# EasyEDA Pro project ProPrj_Devboard_V2_2025-07-15.epro, schematic Schematic1, sheets 1 to 3 of 7

## Sheets
1 P1: Board Name: Board1; Create Date: 2025-05-25; Page Name: P1; Project Name: Devboard_V2; Schematic Name: Schematic1; Update Date: 2025-07-09; Company: EasyEDA.com; Page Size: A4; Version: V1.0
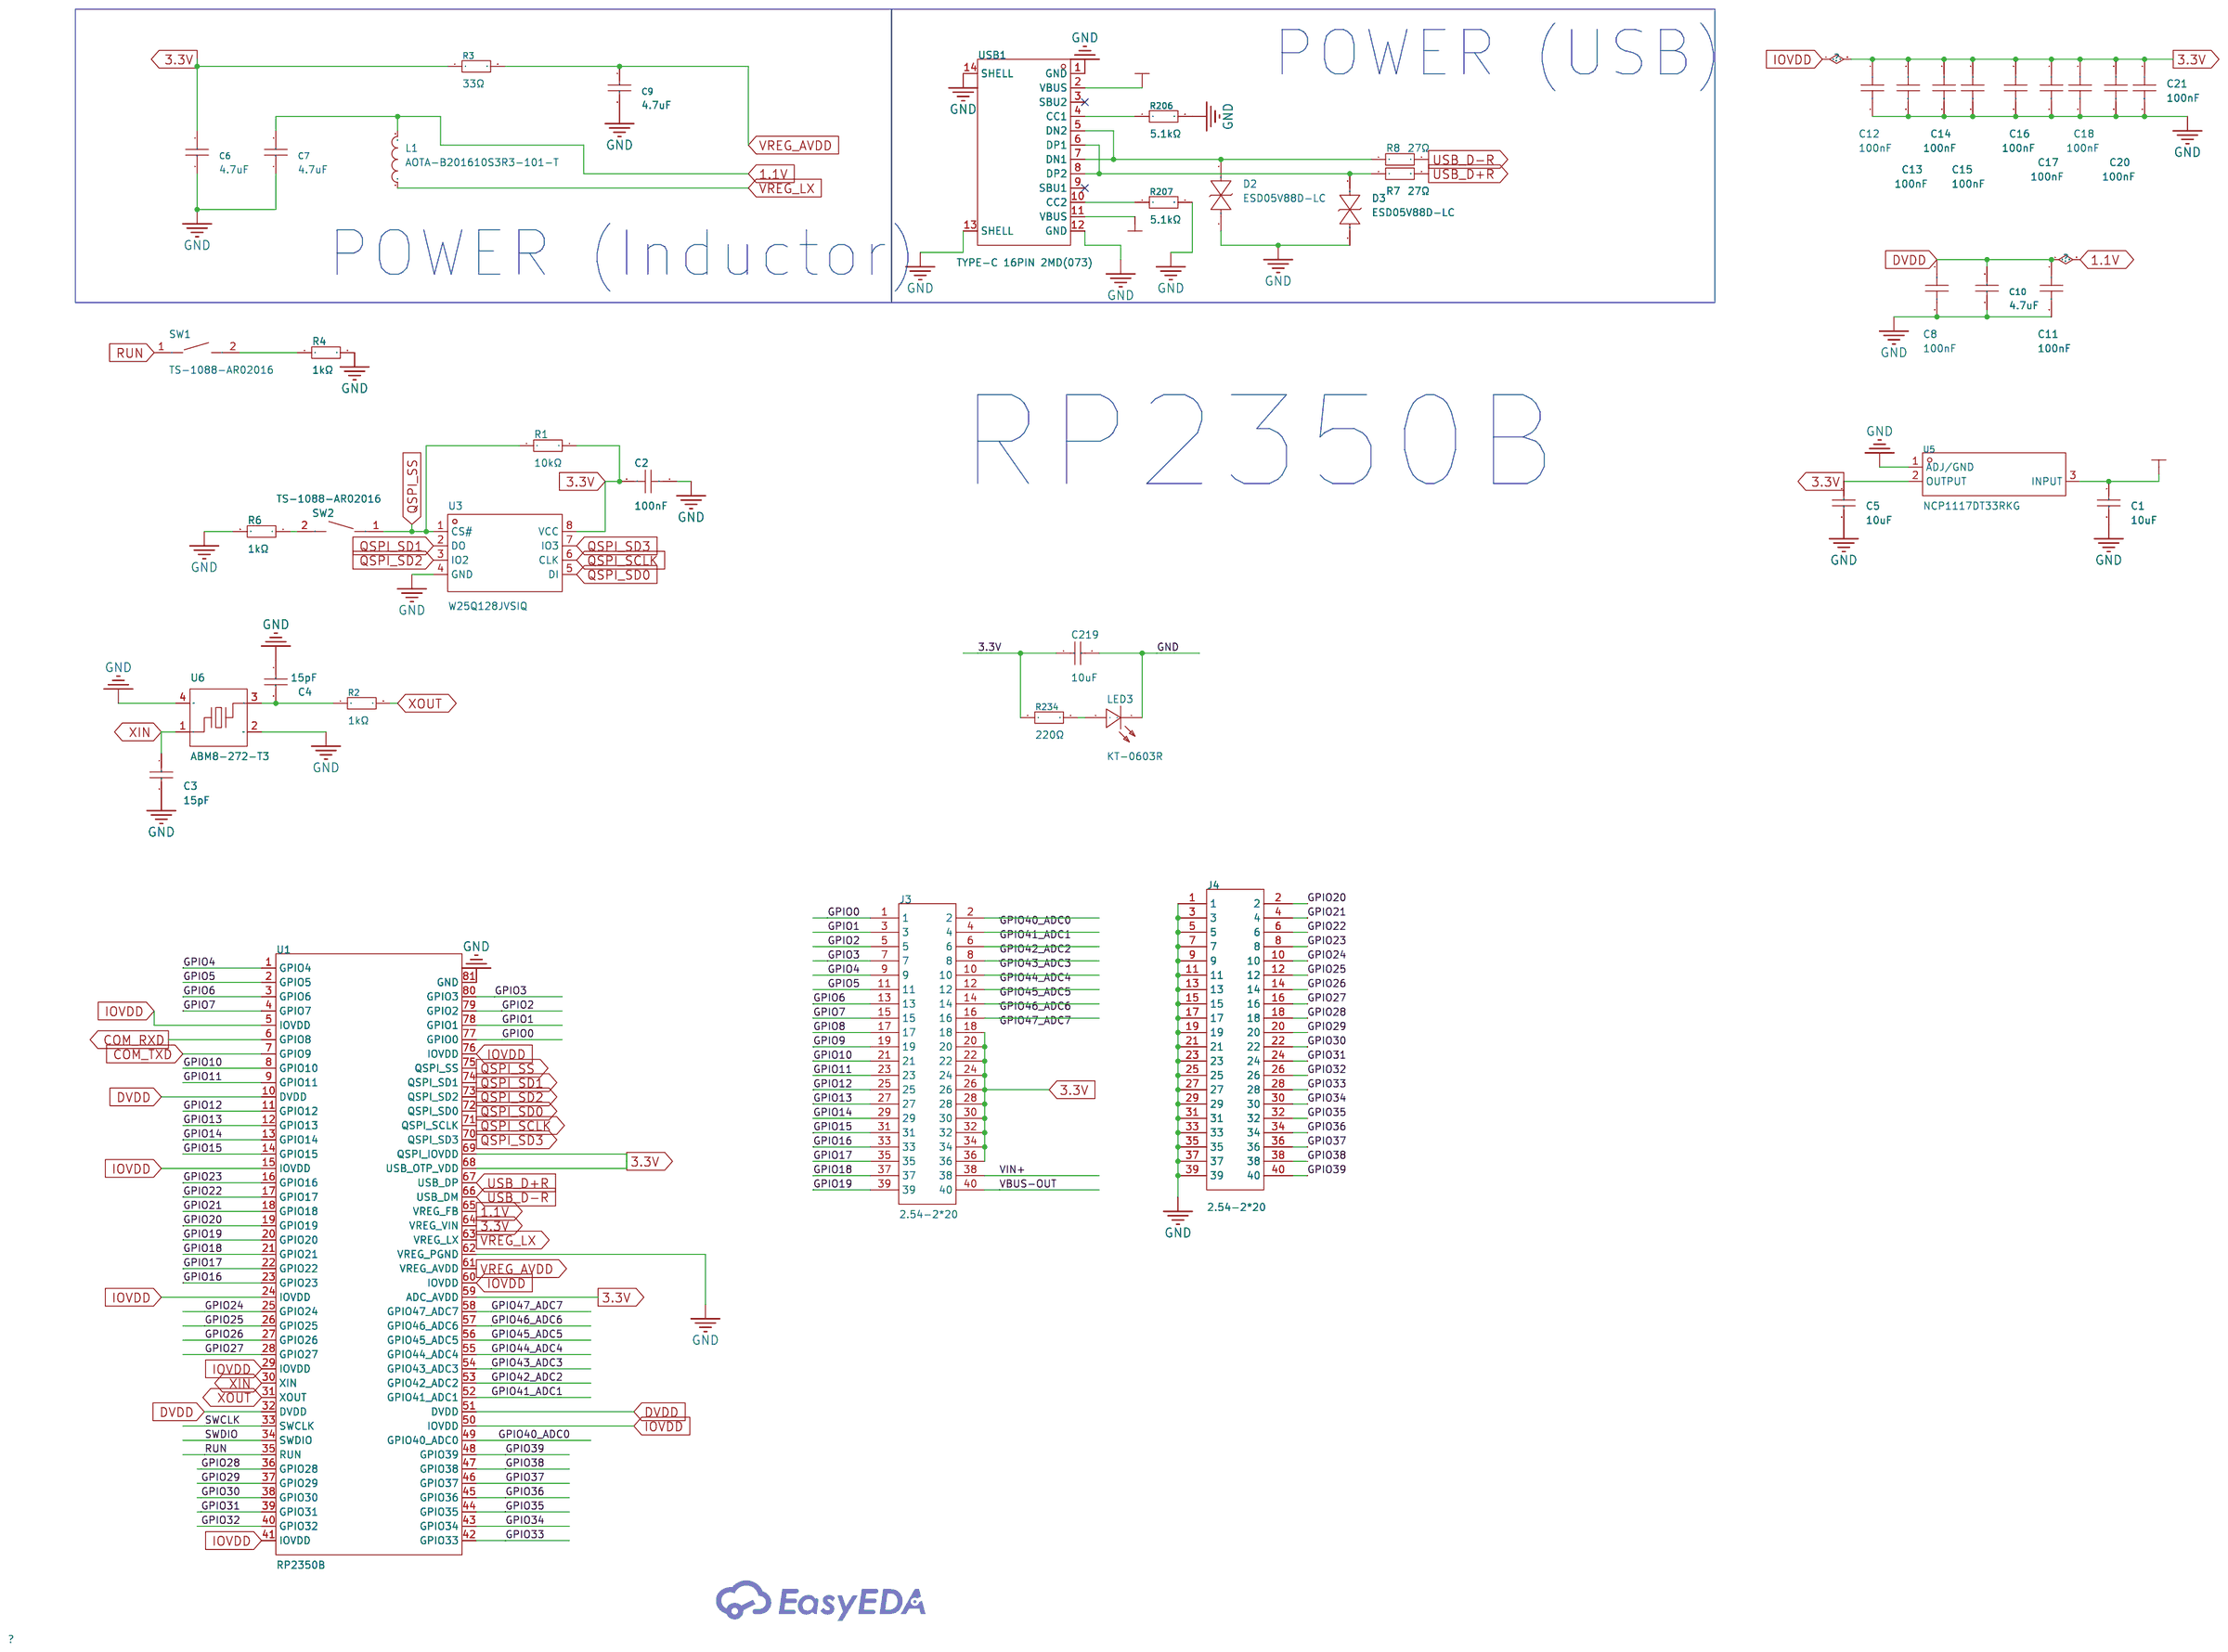
[diagram p0: P1]
2 P2: Create Date: 2025-05-26; Page Name: P2
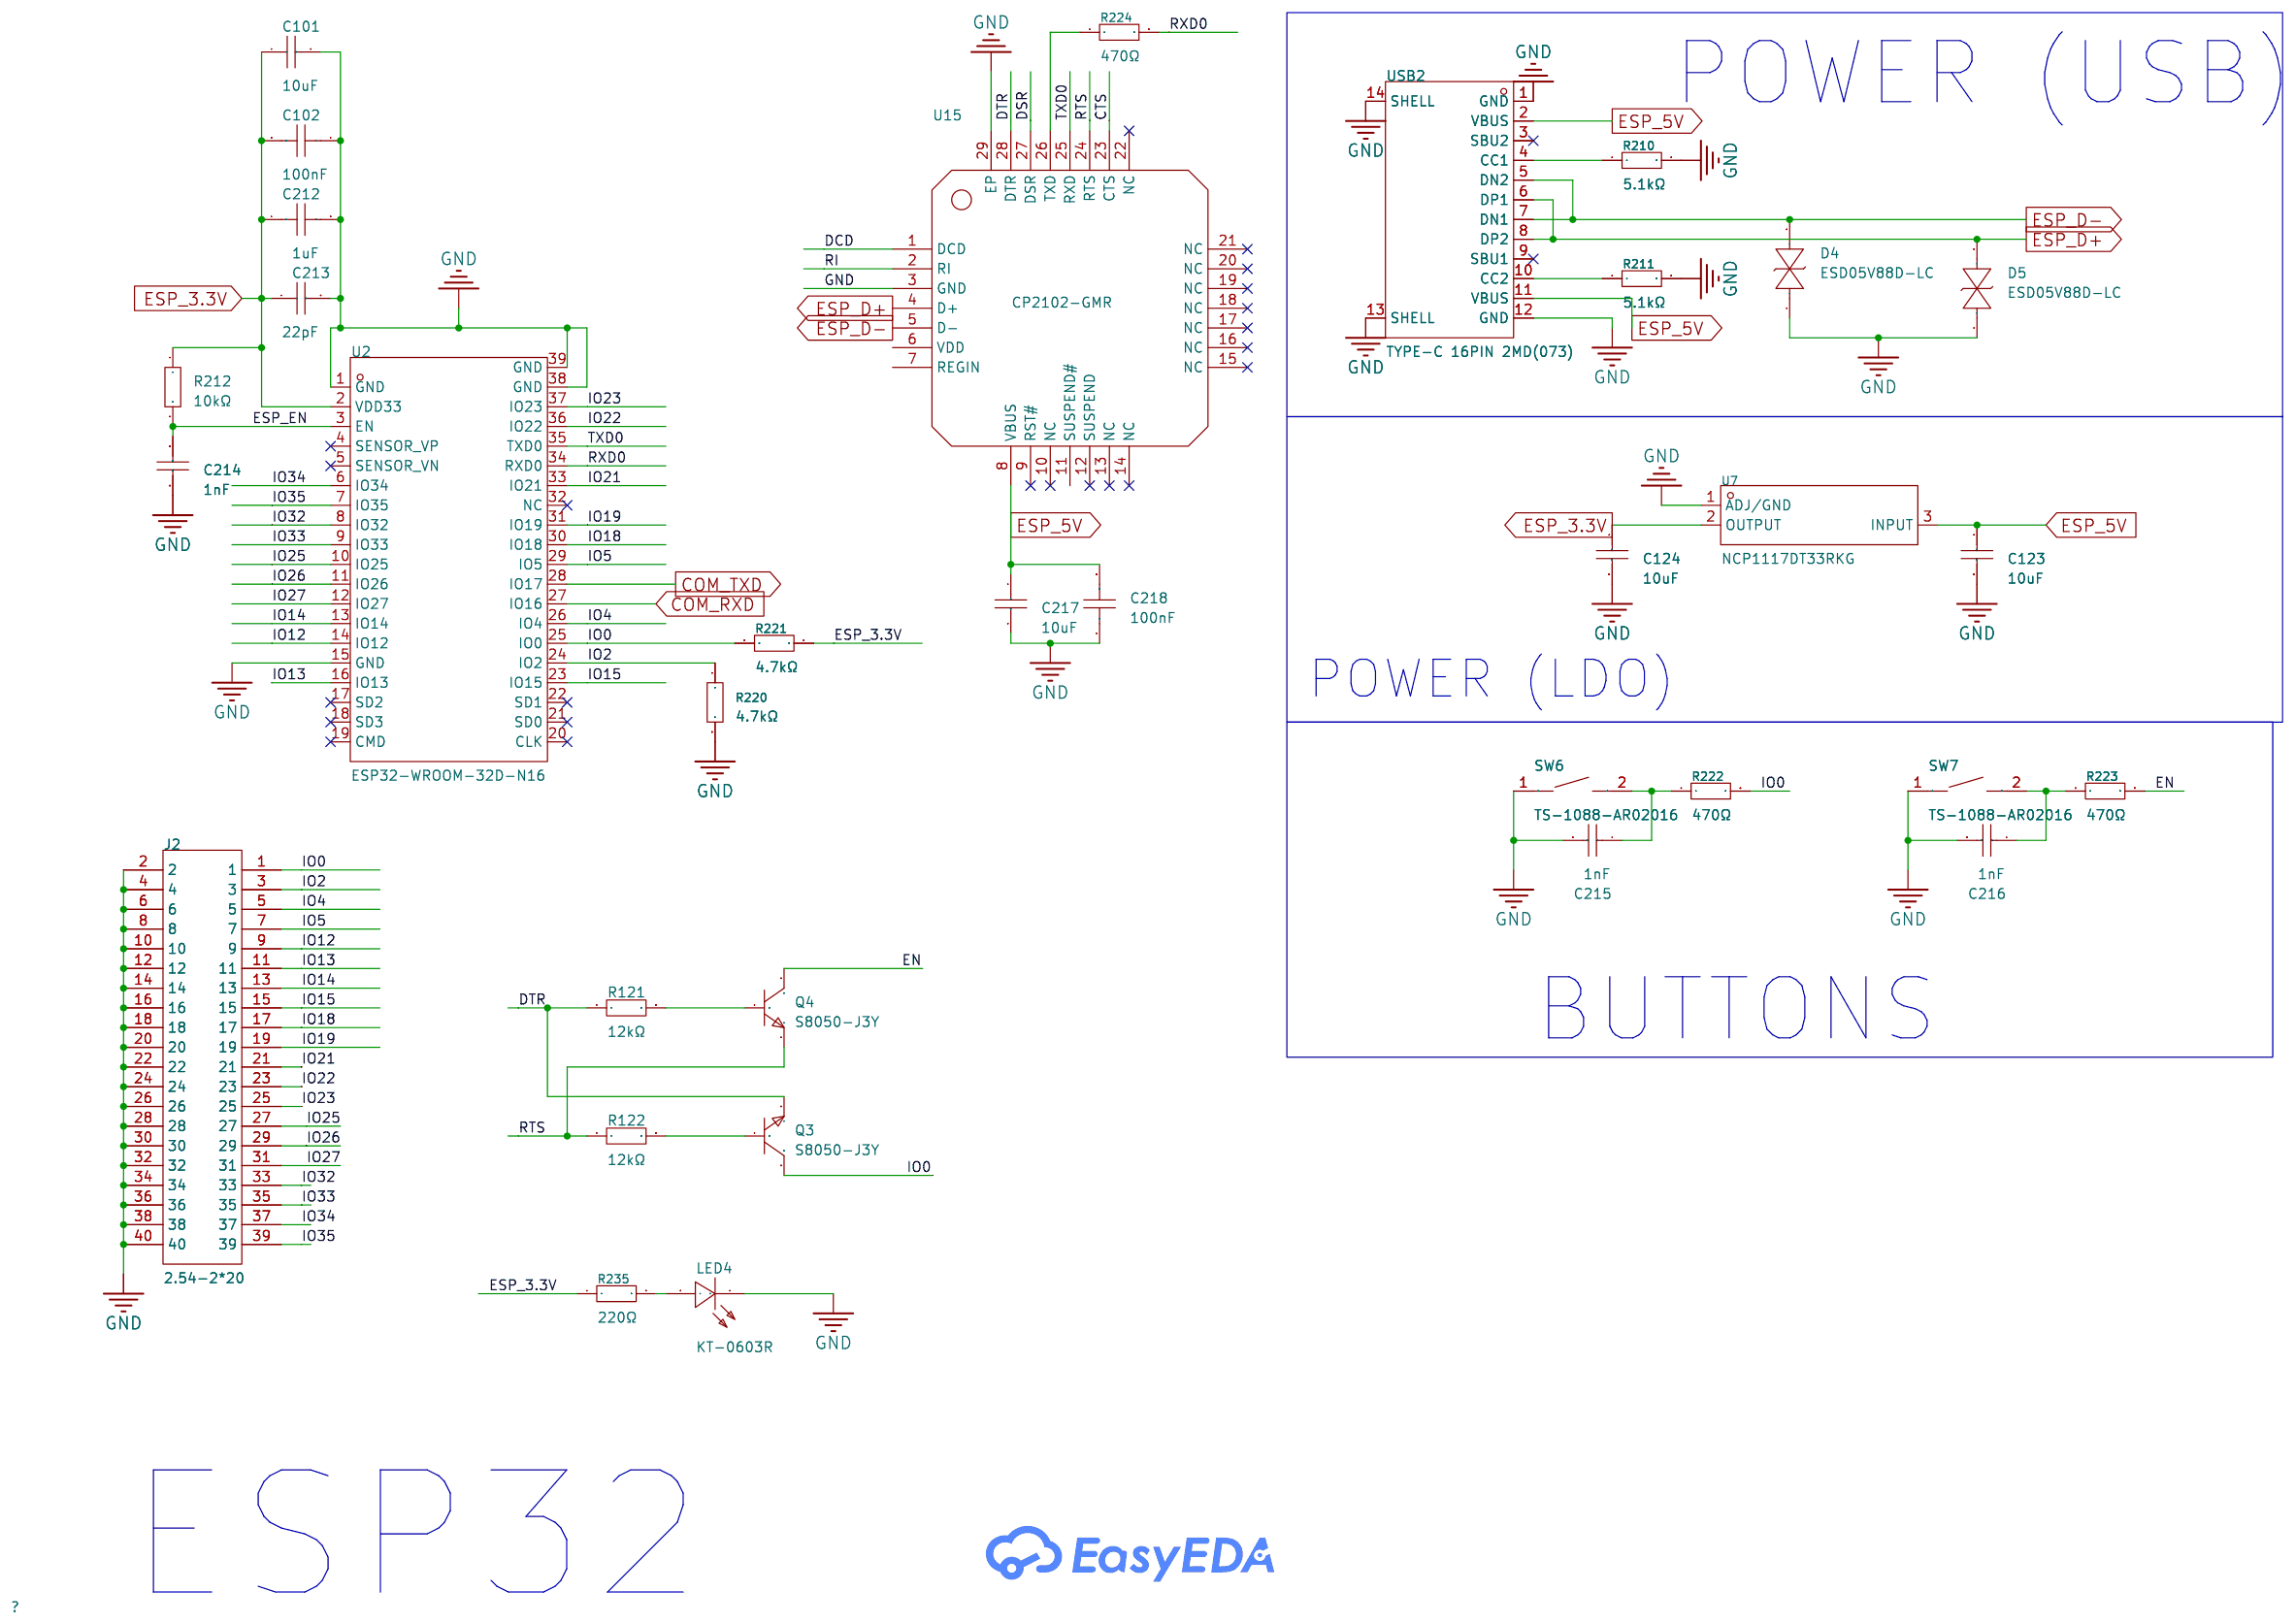
[diagram p1: P2]
3 P3: Create Date: 2025-06-10; Page Name: P3; Update Date: 2025-07-14
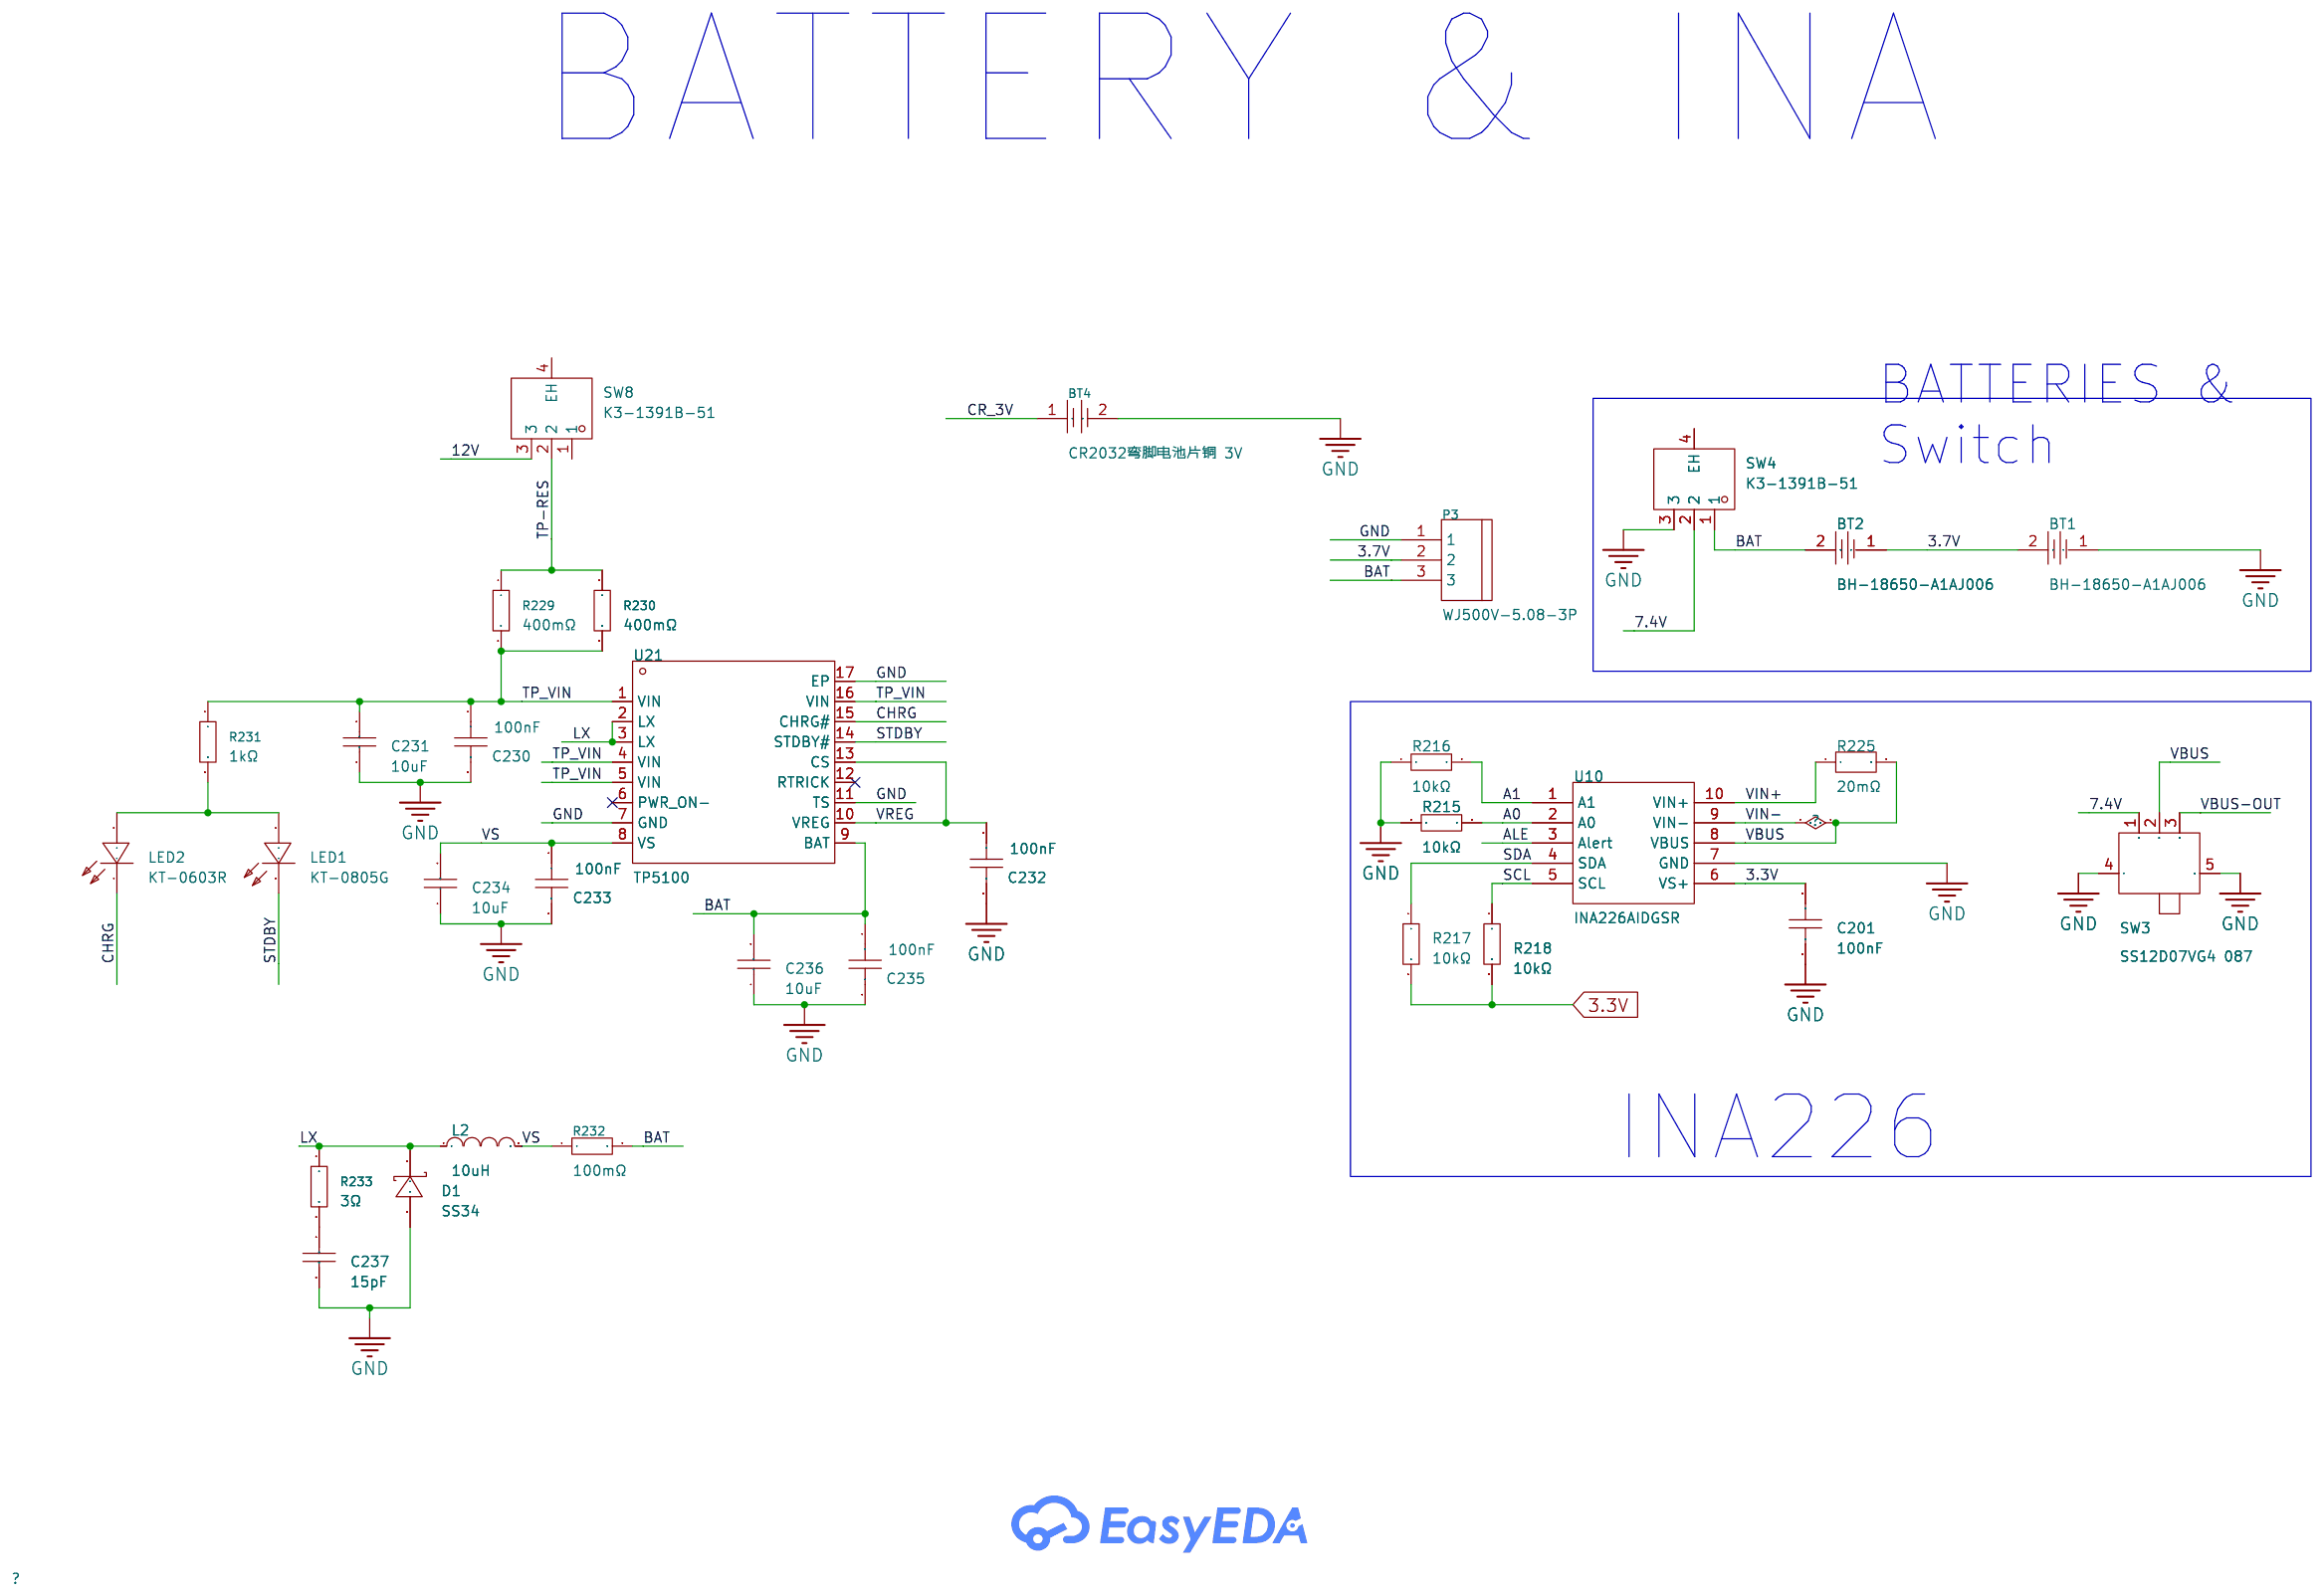
[diagram p2: P3]

## Parts
sheet P1
C1  10uF  [C0402]
C2  100nF  [C0402]
C3  15pF  [C0402]
C4  15pF  [C0402]
C5  10uF  [C0402]
C6  4.7uF  [C0402]
C7  4.7uF  [C0402]
C8  100nF  [C0402]
C9  4.7uF  [C0402]
C10  4.7uF  [C0402]
C11  100nF  [C0402]
C12  100nF  [C0402]
C13  100nF  [C0402]
C14  100nF  [C0402]
C15  100nF  [C0402]
C16  100nF  [C0402]
C17  100nF  [C0402]
C18  100nF  [C0402]
C20  100nF  [C0402]
C21  100nF  [C0402]
C219  10uF  [C0402]
D2  ESD05V88D-LC  [DFN1006-2L-BI]
D3  ESD05V88D-LC  [DFN1006-2L-BI]
J3  2.54-2*20  [HDR-TH_40P-P2.54-V-F-R2-C20-S2.54]
J4  2.54-2*20  [HDR-TH_40P-P2.54-V-F-R2-C20-S2.54]
L1  AOTA-B201610S3R3-101-T  [IND-SMD_L2.0-W1.6_AOTA-B201610S3R3-101-T]
LED3  KT-0603R  [LED0603-RD]
R1  10kΩ  [R0402]
R2  1kΩ  [R0402]
R3  33Ω  [R0402]
R4  1kΩ  [R0402]
R6  1kΩ  [R0402]
R7  27Ω  [R0402]
R8  27Ω  [R0402]
R206  5.1kΩ  [R0402]
R207  5.1kΩ  [R0402]
R234  220Ω  [R0603]
SW1  TS-1088-AR02016  [SW-SMD_L3.9-W3.0-P4.45]
SW2  TS-1088-AR02016  [SW-SMD_L3.9-W3.0-P4.45]
U1  RP2350B  [QFN-80_L10.0-W10.0-P0.40-TL-EP3.4]
U3  W25Q128JVSIQ  [SOIC-8_L5.3-W5.3-P1.27-LS8.0-BL]
U5  NCP1117DT33RKG  [TO-252-2_L6.6-W6.1-P4.57-LS9.9-TL-CW]
U6  ABM8-272-T3  [CRYSTAL-SMD_4P-L3.2-W2.5-BL]
USB1  TYPE-C 16PIN 2MD(073)  [USB-C-SMD_TYPE-C-6PIN-2MD-073]
sheet P2
C101  10uF  [C0402]
C102  100nF  [C0402]
C123  10uF  [C0402]
C124  10uF  [C0402]
C212  1uF  [C0402]
C213  22pF  [C0402]
C214  1nF  [C0402]
C215  1nF  [C0402]
C216  1nF  [C0402]
C217  10uF  [C0402]
C218  100nF  [C0402]
D4  ESD05V88D-LC  [DFN1006-2L-BI]
D5  ESD05V88D-LC  [DFN1006-2L-BI]
J2  2.54-2*20  [HDR-TH_40P-P2.54-V-F-R2-C20-S2.54]
LED4  KT-0603R  [LED0603-RD]
Q3  S8050-J3Y  [SOT-23-3_L3.0-W1.7-P0.95-LS2.9-BR]
Q4  S8050-J3Y  [SOT-23-3_L3.0-W1.7-P0.95-LS2.9-BR]
R121  12kΩ  [R0402]
R122  12kΩ  [R0402]
R210  5.1kΩ  [R0402]
R211  5.1kΩ  [R0402]
R212  10kΩ  [R0402]
R220  4.7kΩ  [R0402]
R221  4.7kΩ  [R0402]
R222  470Ω  [R0402]
R223  470Ω  [R0402]
R224  470Ω  [R0402]
R235  220Ω  [R0603]
SW6  TS-1088-AR02016  [SW-SMD_L3.9-W3.0-P4.45]
SW7  TS-1088-AR02016  [SW-SMD_L3.9-W3.0-P4.45]
U2  ESP32-WROOM-32D-N16  [WIFIM-SMD_39P-L25.5-W18.0-P1.27-BL]
U7  NCP1117DT33RKG  [TO-252-2_L6.6-W6.1-P4.57-LS9.9-TL-CW]
U15  CP2102-GMR  [WQFN-28_L5.0-W5.0-P0.50-BL-EP3.2]
USB2  TYPE-C 16PIN 2MD(073)  [USB-C-SMD_TYPE-C-6PIN-2MD-073]
sheet P3
BT1  BH-18650-A1AJ006  [BAT-TH_BH-18650-A1AJ006]
BT2  BH-18650-A1AJ006  [BAT-TH_BH-18650-A1AJ006]
BT4  CR2032弯脚电池片铜 3V  [BAT-SMD_CR2032-3V]
C201  100nF  [C0402]
C230  100nF  [C0402]
C231  10uF  [C0603]
C232  100nF  [C0402]
C233  100nF  [C0402]
C234  10uF  [C0603]
C235  100nF  [C0402]
C236  10uF  [C0603]
C237  15pF  [C0402]
D1  SS34  [SMA_L4.3-W2.6-LS5.2-RD]
L2  10uH  [IND-SMD_L5.4-W5.2_FXL0530]
LED1  KT-0805G  [LED0805-R-RD]
LED2  KT-0603R  [LED0603-RD]
P3  WJ500V-5.08-3P  [CONN-TH_3P-P5.00_WJ500V-5.08-3P]
R215  10kΩ  [R0402]
R216  10kΩ  [R0402]
R217  10kΩ  [R0402]
R218  10kΩ  [R0402]
R225  20mΩ  [RES-SMD_L6.4-W3.2-R2512]
R229  400mΩ  [R1206]
R230  400mΩ  [R1206]
R231  1kΩ  [R0402]
R232  100mΩ  [R1206]
R233  3Ω  [R0402]
SW3  SS12D07VG4 087  [SW-TH_SS12D07VG4]
SW4  K3-1391B-51  [SW-TH_K3-1391B-51]
SW8  K3-1391B-51  [SW-TH_K3-1391B-51]
U10  INA226AIDGSR  [MSOP-10_L3.0-W3.0-P0.50-LS5.0-BL]
U21  TP5100  [TQFN-16_L4.0-W4.0-P0.65-BL-EP]

## Library data of the parts
C1 C5 C101 C123 C124 C217 C219 = CL05A106MQ5NUNC: Capacitance: Tolerance:±20% Tolerance:±20% Voltage Rated: Temperature Coefficient:; LCSC Part Name: 10uF ±20% 6.3V; Supplier Part: C15525; Manufacturer: SAMSUNG(三星); Supplier Footprint: 0402; JLCPCB Part Class: Basic Part; Datasheet: https://atta.szlcsc.com/upload/public/pdf/source/20220823/2B02EE04F8F211D38A52DCB16EB6BEBA.pdf; Supplier: LCSC; Tolerance: ±20%
C2 C8 C11-C18 C20 C21 C102 C201 C218 C230 C232 C233 C235 = CL05B104KO5NNNC: Capacitance: Tolerance:±10% Tolerance:±10% Voltage Rated: Temperature Coefficient:; LCSC Part Name: 100nF ±10% 16V; Supplier Part: C1525; Manufacturer: SAMSUNG(三星); Supplier Footprint: 0402; JLCPCB Part Class: Basic Part; Datasheet: https://atta.szlcsc.com/upload/public/pdf/source/20160218/1457707763339.pdf; Supplier: LCSC; Tolerance: ±10%
C3 C4 C237 = 0402CG150J500NT: Capacitance: Tolerance:±5% Tolerance:±5% Voltage Rated: Temperature Coefficient:; LCSC Part Name: 15pF ±5% 50V; Supplier Part: C1548; Manufacturer: FH(风华); Supplier Footprint: 0402; JLCPCB Part Class: Basic Part; Datasheet: https://atta.szlcsc.com/upload/public/pdf/source/20200305/C486355_26A10D38EF8C2A5C37091D0039909270.pdf; Supplier: LCSC; Tolerance: ±5%
C6 C7 C9 C10 = CL05A475MP5NRNC: Capacitance: Tolerance:±20% Tolerance:±20% Voltage Rated: Temperature Coefficient:; LCSC Part Name: 4.7uF ±20% 10V; Supplier Part: C23733; Manufacturer: SAMSUNG(三星); Supplier Footprint: 0402; JLCPCB Part Class: Basic Part; Datasheet: https://atta.szlcsc.com/upload/public/pdf/source/20160218/1457707763339.pdf; Supplier: LCSC; Tolerance: ±20%
D2-D5 = ESD05V88D-LC_C5139330: Supplier Part: C5139330; Manufacturer: Leiditech(雷卯电子); Supplier Footprint: DFN1006; JLCPCB Part Class: Extended Part; Datasheet: https://atta.szlcsc.com/upload/public/pdf/source/20220816/2C4BB2D73BD9CA5940291356D3492357.pdf; Supplier: LCSC
J2-J4 = 2.54-2*20: Holes Structure:2x20P Pitch:2.54mm Row Spacing:2.54mm Circular Hole / Square Hole:Square Holes Mounting Type:Straight Number of Rows:双排 Number of Holes:40P Current Rating (Max):2.5A Voltage Rating (Max):- Holes Direction:Top Insulation Height:8.5mm Operat; LCSC Part Name: 间距:2.54mm 2x20P 直插; Supplier Part: C2977589; Manufacturer: ZHOURI(洲日); Supplier Footprint: 插件,P=2.54mm; JLCPCB Part Class: Extended Part; Datasheet: https://atta.szlcsc.com/upload/public/pdf/source/20220328/834E302BE3C038BBC5C70F5E02589B1E.pdf; Supplier: LCSC; Holes Structure: 2x20P; Pitch: 2.54mm; Row Spacing: 2.54mm; Circular Hole / Square Hole: Square Holes; Mounting Type: Straight; Number of Rows: 双排; Number of Holes: 40P; Current Rating (Max): 2.5A; Holes Direction: Top; Insulation Height: 8.5mm; Operating Temperature Range: -40℃~+105℃
L1 = AOTA-B201610S3R3-101-T: Supplier Part: C42411119; Manufacturer: ABRACON; Supplier Footprint: 0806; JLCPCB Part Class: Extended Part; Datasheet: https://atta.szlcsc.com/upload/public/pdf/source/20241210/8ED7235334351200B2CE75E3CBC0DAAD.pdf; Supplier: LCSC
LED2-LED4 = KT-0603R: Emitted Color:Red Power Dissipation:- Forward Current:- Dominant Wavelength:- Dominant Wavelength:- Peak Wavelength:- Diode Configuration:- Lens Color:- Color Temperature:- Color Temperature:- Viewing Angle:- Mounting Sytle:- Operating Temperature:-40℃~+8; LCSC Part Name: 0603 红灯 高亮; Supplier Part: C2286; Manufacturer: KENTO; Supplier Footprint: 0603; JLCPCB Part Class: Basic Part; Datasheet: https://atta.szlcsc.com/upload/public/pdf/source/20160616/1466072038404.pdf; Supplier: LCSC; Emitted Color: Red; Operating Temperature: -40℃~+85℃
R1 R212 R215-R218 = 0402WGF1002TCE: Type:Thick Film Resistors Resistance:10kΩ Tolerance:±1% Tolerance:±1% Power(Watts): Overload Voltage (Max): Temperature Coefficient:±100ppm/℃ Temperature Coefficient:±100ppm/℃ Operating Temperature Range:-55℃~+155℃ Operating Temperature Range:-55℃~+155℃; LCSC Part Name: 10kΩ ±1% 62.5mW 厚膜电阻; Supplier Part: C25744; Manufacturer: UNI-ROYAL(厚声); Supplier Footprint: 0402; JLCPCB Part Class: Basic Part; Datasheet: https://atta.szlcsc.com/upload/public/pdf/source/20200306/C422600_1E6D84923E4A46A82E41ADD87F860B5C.pdf; Supplier: LCSC; Type: Thick Film Resistors; Tolerance: ±1%; Temperature Coefficient: ±100ppm/℃; Operating Temperature Range: -55℃~+155℃
R2 R4 R6 R231 = 0402WGF1001TCE: Type:Thick Film Resistors Resistance:1kΩ Tolerance:±1% Tolerance:±1% Power(Watts): Overload Voltage (Max): Temperature Coefficient:±100ppm/℃ Temperature Coefficient:±100ppm/℃ Operating Temperature Range:-55℃~+155℃ Operating Temperature Range:-55℃~+155℃; LCSC Part Name: 1kΩ ±1% 62.5mW 厚膜电阻; Supplier Part: C11702; Manufacturer: UNI-ROYAL(厚声); Supplier Footprint: 0402; JLCPCB Part Class: Basic Part; Datasheet: https://atta.szlcsc.com/upload/public/pdf/source/20200306/C422600_1E6D84923E4A46A82E41ADD87F860B5C.pdf; Supplier: LCSC; Type: Thick Film Resistors; Tolerance: ±1%; Temperature Coefficient: ±100ppm/℃; Operating Temperature Range: -55℃~+155℃
R3 = 0402WGF330JTCE: Type:Thick Film Resistors Resistance:33Ω Tolerance:±1% Tolerance:±1% Power(Watts): Overload Voltage (Max): Temperature Coefficient:±100ppm/℃ Temperature Coefficient:±100ppm/℃ Operating Temperature Range:-55℃~+155℃ Operating Temperature Range:-55℃~+155℃; LCSC Part Name: 33Ω ±1% 62.5mW 厚膜电阻; Supplier Part: C25105; Manufacturer: UNI-ROYAL(厚声); Supplier Footprint: 0402; JLCPCB Part Class: Basic Part; Datasheet: https://atta.szlcsc.com/upload/public/pdf/source/20200306/C422600_1E6D84923E4A46A82E41ADD87F860B5C.pdf; Supplier: LCSC; Type: Thick Film Resistors; Tolerance: ±1%; Temperature Coefficient: ±100ppm/℃; Operating Temperature Range: -55℃~+155℃
R7 R8 = 0402WGF270JTCE: Type:Thick Film Resistors Resistance:27Ω Tolerance:±1% Tolerance:±1% Power(Watts): Overload Voltage (Max): Temperature Coefficient:±100ppm/℃ Temperature Coefficient:±100ppm/℃ Operating Temperature Range:-55℃~+155℃ Operating Temperature Range:-55℃~+155℃; LCSC Part Name: 27Ω ±1% 62.5mW 厚膜电阻; Supplier Part: C25100; Manufacturer: UNI-ROYAL(厚声); Supplier Footprint: 0402; JLCPCB Part Class: Extended Part; Datasheet: https://atta.szlcsc.com/upload/public/pdf/source/20200306/C422600_1E6D84923E4A46A82E41ADD87F860B5C.pdf; Supplier: LCSC; Type: Thick Film Resistors; Tolerance: ±1%; Temperature Coefficient: ±100ppm/℃; Operating Temperature Range: -55℃~+155℃
R206 R207 R210 R211 = 0402WGF5101TCE: Type:Thick Film Resistors Resistance:5.1kΩ Tolerance:±1% Tolerance:±1% Power(Watts): Overload Voltage (Max): Temperature Coefficient:±100ppm/℃ Temperature Coefficient:±100ppm/℃ Operating Temperature Range:-55℃~+155℃ Operating Temperature Range:-55℃~+155℃; LCSC Part Name: 5.1kΩ ±1% 62.5mW 厚膜电阻; Supplier Part: C25905; Manufacturer: UNI-ROYAL(厚声); Supplier Footprint: 0402; JLCPCB Part Class: Basic Part; Datasheet: https://atta.szlcsc.com/upload/public/pdf/source/20200306/C422600_1E6D84923E4A46A82E41ADD87F860B5C.pdf; Supplier: LCSC; Type: Thick Film Resistors; Tolerance: ±1%; Temperature Coefficient: ±100ppm/℃; Operating Temperature Range: -55℃~+155℃
R234 R235 = 0603WAF2200T5E: Type:Thick Film Resistors Resistance: Tolerance:±1% Tolerance:±1% Power(Watts): Overload Voltage (Max): Temperature Coefficient:±100ppm/℃ Temperature Coefficient:±100ppm/℃ Operating Temperature Range:-55℃~+155℃ Operating Temperature Range:-55℃~+155℃; LCSC Part Name: 220Ω ±1% 100mW 厚膜电阻; Supplier Part: C22962; Manufacturer: UNI-ROYAL(厚声); Supplier Footprint: 0603; JLCPCB Part Class: Basic Part; Datasheet: https://atta.szlcsc.com/upload/public/pdf/source/20200306/C422600_1E6D84923E4A46A82E41ADD87F860B5C.pdf; Supplier: LCSC; Type: Thick Film Resistors; Tolerance: ±1%; Temperature Coefficient: ±100ppm/℃; Operating Temperature Range: -55℃~+155℃
SW1 SW2 SW6 SW7 = TS-1088-AR02016: Circuit:SPST Actuator Style:Round Button Operating Force:160gf Mounting Style:Brick nogging Switch Length:4mm Switch Width:3mm Switch Height:2mm Strike Gundam:不带 Contact Current:50mA Voltage Rating (DC):12V Insulation Resistance:100MΩ Actuator/Cap Color:B; LCSC Part Name: 4*3*2mm 立贴 轻触开关; Supplier Part: C720477; Manufacturer: XUNPU(讯普); Supplier Footprint: SMD; JLCPCB Part Class: Basic Part; Datasheet: https://atta.szlcsc.com/upload/public/pdf/source/20200810/C720475_60D09DD6C54279ADDB2DC25100F1CC11.pdf; Supplier: LCSC; Circuit: SPST; Actuator Style: Round Button; Operating Force: 160gf; Mounting Style: Brick nogging; Switch Length: 4mm; Switch Width: 3mm; Switch Height: 2mm; Strike Gundam: 不带; Contact Current: 50mA; Voltage Rating (DC): 12V; Insulation Resistance: 100MΩ; Actuator/Cap Color: Black; Pin Style: SMDSplicing; Mechanical Life: 10万次; Operating Temperature: -30℃~+80℃
U1 = RP2350B_C42415655: Supplier Part: C42415655; Manufacturer: Raspberry Pi(树莓派); Supplier Footprint: QFN-80-EP(10x10); JLCPCB Part Class: Extended Part; Datasheet: https://atta.szlcsc.com/upload/public/pdf/source/20241210/0989AB86AAD7A21936E5CD12ADC9EA29.pdf; Supplier: LCSC
U3 = W25Q128JVSIQ: Interface Type:SPI Memory Size:128Mbit Clock Frequency (fc):133MHz Supply Voltage:2.7V~3.6V Supply Voltage:2.7V~3.6V Page Programming Time (Tpp):700us Block Erase Time (tBE):120ms@(32KB) Data Retention - TDR (Year):20 years Operating Temperature:-40℃~+85℃; LCSC Part Name: W25Q128JVSIQ 编带; Supplier Part: C97521; Manufacturer: WINBOND(华邦); Supplier Footprint: SOIC-8-208mil; JLCPCB Part Class: Basic Part; Datasheet: https://atta.szlcsc.com/upload/public/pdf/source/20170316/1489627409956.pdf; Supplier: LCSC; Interface Type: SPI; Memory Size: 128Mbit; Clock Frequency (fc): 133MHz; Supply Voltage: 2.7V~3.6V; Page Programming Time (Tpp): 700us; Block Erase Time (tBE): 120ms@(32KB); Data Retention - TDR (Year): 20 years; Operating Temperature: -40℃~+85℃
U5 U7 = NCP1117DT33RKG: Output Type: Maximum Input Voltage:20V Output Voltage:3.3V Output Voltage:3.3V MAX Output Current:1A Power Supply Rejection Ratio (PSRR):64dB@(120Hz) Dropout Voltage:1.2V@(800mA) standby current:10mA Operating Temperature:0℃~+125℃ Operating Temperature:0℃; LCSC Part Name: 输入20V 输出3.3V 1A; Supplier Part: C88234; Manufacturer: onsemi(安森美); Supplier Footprint: TO-252-2(DPAK); JLCPCB Part Class: Extended Part; Datasheet: https://atta.szlcsc.com/upload/public/pdf/source/20180713/C233237_751C9E9ABCFEB70C62A2D3109B40BDA0.pdf; Supplier: LCSC; Maximum Input Voltage: 20V; Output Voltage: 3.3V; MAX Output Current: 1A; Power Supply Rejection Ratio (PSRR): 64dB@(120Hz); Dropout Voltage: 1.2V@(800mA); standby current: 10mA; Operating Temperature: 0℃~+125℃; Output Polarity: Positive electrode; Number of Outputs: 1
U6 = ABM8-272-T3_C20625731: Supplier Part: C20625731; Manufacturer: ABRACON; Supplier Footprint: SMD3225-4P; JLCPCB Part Class: Extended Part; Datasheet: https://atta.szlcsc.com/upload/public/pdf/source/20240227/A8BE43F636D80F75C9AF5C59EDF21E9A.pdf; Supplier: LCSC
USB1 USB2 = TYPE-C 16PIN 2MD(073): Connector Type:Type-C Standard:USB 3.1 Gender:Female Mounting Style:Horizontal attachment Number of Contacts:16P Number of Ports:1 Current Rating - Power (Max):5A Operating Temperature Range:-25℃~+85℃ Operating Temperature Range:-25℃~+85℃ Rated Voltage (M; LCSC Part Name: Type-C 母 卧贴; Supplier Part: C2765186; Manufacturer: SHOU HAN(首韩); Supplier Footprint: SMD; JLCPCB Part Class: Extended Part; Datasheet: https://atta.szlcsc.com/upload/public/pdf/source/20211123/39B17C16241EAC15C5E277BDA434118E.pdf; Supplier: LCSC; Connector Type: Type-C; Standard: USB 3.1; Gender: Female; Mounting Style: Horizontal attachment; Number of Contacts: 16P; Number of Ports: 1; Current Rating - Power (Max): 5A; Operating Temperature Range: -25℃~+85℃; Rated Voltage (Max): 5V; Connect-Disconnect Life: 5000 Cuts; Core Colour: Black
C212 = CL05A105KA5NQNC: Capacitance: Tolerance:±10% Tolerance:±10% Voltage Rated: Temperature Coefficient:; LCSC Part Name: 1uF ±10% 25V; Supplier Part: C52923; Manufacturer: SAMSUNG(三星); Supplier Footprint: 0402; JLCPCB Part Class: Basic Part; Datasheet: https://atta.szlcsc.com/upload/public/pdf/source/20160218/1457707763339.pdf; Supplier: LCSC; Tolerance: ±10%
C213 = 0402CG220J500NT: Capacitance: Tolerance:±5% Tolerance:±5% Voltage Rated: Temperature Coefficient:; LCSC Part Name: 22pF ±5% 50V; Supplier Part: C1555; Manufacturer: FH(风华); Supplier Footprint: 0402; JLCPCB Part Class: Basic Part; Datasheet: https://atta.szlcsc.com/upload/public/pdf/source/20200305/C486355_26A10D38EF8C2A5C37091D0039909270.pdf; Supplier: LCSC; Tolerance: ±5%
C214-C216 = 0402B102K500NT: Capacitance:1nF Tolerance:±10% Tolerance:±10% Voltage Rated: Temperature Coefficient:; LCSC Part Name: 1nF ±10% 50V; Supplier Part: C1523; Manufacturer: FH(风华); Supplier Footprint: 0402; JLCPCB Part Class: Basic Part; Datasheet: https://atta.szlcsc.com/upload/public/pdf/source/20200305/C486355_26A10D38EF8C2A5C37091D0039909270.pdf; Supplier: LCSC; Tolerance: ±10%
Q3 Q4 = S8050-J3Y: type:NPN Current - Collector(Ic): Collector - Emitter Voltage VCEO: Pd - Power Dissipation:300mW DC Current Gain:120@500mA,1V DC Current Gain:120@500mA,1V Transition frequency(fT):150MHz Current - Collector Cutoff:100nA Vce Saturation(VCE(sat)):600mV Oper; Supplier Part: C364312; Manufacturer: MDD(辰达半导体); Supplier Footprint: SOT-23; JLCPCB Part Class: Extended Part; Datasheet: https://atta.szlcsc.com/upload/public/pdf/source/20241121/97BBBA232BCC69760BB5FA02C7A73959.pdf; Supplier: LCSC; type: NPN; Pd - Power Dissipation: 300mW; DC Current Gain: 120@500mA,1V; Transition frequency(fT): 150MHz; Current - Collector Cutoff: 100nA; Vce Saturation(VCE(sat)): 600mV; Operating Temperature: -55℃~+150℃
R121 R122 = 0402WGF1202TCE: Type:Thick Film Resistors Resistance:12kΩ Tolerance:±1% Tolerance:±1% Power(Watts): Overload Voltage (Max): Temperature Coefficient:±100ppm/℃ Temperature Coefficient:±100ppm/℃ Operating Temperature Range:-55℃~+155℃ Operating Temperature Range:-55℃~+155℃; LCSC Part Name: 12kΩ ±1% 62.5mW 厚膜电阻; Supplier Part: C25752; Manufacturer: UNI-ROYAL(厚声); Supplier Footprint: 0402; JLCPCB Part Class: Basic Part; Datasheet: https://atta.szlcsc.com/upload/public/pdf/source/20200306/C422600_1E6D84923E4A46A82E41ADD87F860B5C.pdf; Supplier: LCSC; Type: Thick Film Resistors; Tolerance: ±1%; Temperature Coefficient: ±100ppm/℃; Operating Temperature Range: -55℃~+155℃
R220 R221 = 0402WGF4701TCE: Type:Thick Film Resistors Resistance:4.7kΩ Tolerance:±1% Tolerance:±1% Power(Watts): Overload Voltage (Max): Temperature Coefficient:±100ppm/℃ Temperature Coefficient:±100ppm/℃ Operating Temperature Range:-55℃~+155℃ Operating Temperature Range:-55℃~+155℃; LCSC Part Name: 4.7kΩ ±1% 62.5mW 厚膜电阻; Supplier Part: C25900; Manufacturer: UNI-ROYAL(厚声); Supplier Footprint: 0402; JLCPCB Part Class: Basic Part; Datasheet: https://atta.szlcsc.com/upload/public/pdf/source/20200306/C422600_1E6D84923E4A46A82E41ADD87F860B5C.pdf; Supplier: LCSC; Type: Thick Film Resistors; Tolerance: ±1%; Temperature Coefficient: ±100ppm/℃; Operating Temperature Range: -55℃~+155℃
R222-R224 = 0402WGF4700TCE: Type:Thick Film Resistors Resistance: Tolerance:±1% Tolerance:±1% Power(Watts): Overload Voltage (Max): Temperature Coefficient:±100ppm/℃ Temperature Coefficient:±100ppm/℃ Operating Temperature Range:-55℃~+155℃ Operating Temperature Range:-55℃~+155℃; LCSC Part Name: 470Ω ±1% 62.5mW 厚膜电阻; Supplier Part: C25117; Manufacturer: UNI-ROYAL(厚声); Supplier Footprint: 0402; JLCPCB Part Class: Basic Part; Datasheet: https://atta.szlcsc.com/upload/public/pdf/source/20200306/C422600_1E6D84923E4A46A82E41ADD87F860B5C.pdf; Supplier: LCSC; Type: Thick Film Resistors; Tolerance: ±1%; Temperature Coefficient: ±100ppm/℃; Operating Temperature Range: -55℃~+155℃
U2 = ESP32-WROOM-32D-N16: LCSC Part Name: 通用型Wi-Fi+BT+BLE MCU模组; Supplier Part: C529578; Manufacturer: ESPRESSIF(乐鑫); Supplier Footprint: SMD,18x25.5mm; JLCPCB Part Class: Extended Part; Datasheet: https://atta.szlcsc.com/upload/public/pdf/source/20200521/C529577_90A62DBC94C4A28650A646C18DE51576.pdf; Supplier: LCSC
U15 = CP2102-GMR: Applications Function:Transceiver Protocol: Number of Channels:- Supply Voltage:3V~3.6V Supply Voltage:3V~3.6V Data Rate:12Mbps Operating Temperature:- Operating Temperature:-; LCSC Part Name: 单芯片USB转UART桥接器; Supplier Part: C6568; Manufacturer: SKYWORKS/SILICON LABS(芯科); Supplier Footprint: WQFN-28-EP(5x5); JLCPCB Part Class: Extended Part; Datasheet: https://atta.szlcsc.com/upload/public/pdf/source/20170103/1483439882795.pdf; Supplier: LCSC; Applications Function: Transceiver; Supply Voltage: 3V~3.6V; Data Rate: 12Mbps
BT1 BT2 = BH-18650-A1AJ006: Connector Type:Battery box Battery Type:- Contact Plating:Nickel Operating Temperature Range:-10℃~+100℃ Operating Temperature Range:-10℃~+100℃; LCSC Part Name: 电池盒; Supplier Part: C5290175; Manufacturer: MYOUNG(美阳); JLCPCB Part Class: Extended Part; Datasheet: https://atta.szlcsc.com/upload/public/pdf/source/20221129/6A895ABB0802E35760FE4A36BAA105B3.pdf; Supplier: LCSC; Connector Type: Battery box; Contact Plating: Nickel; Operating Temperature Range: -10℃~+100℃
BT4 = CR2032弯脚电池片铜 3V: Connector Type:Battery button Battery Type:CR2032 Operating Temperature Range:- Operating Temperature Range:-; Supplier Part: C70373; Manufacturer: Q&J; Supplier Footprint: SMD; JLCPCB Part Class: Extended Part; Datasheet: https://atta.szlcsc.com/upload/public/pdf/source/20160427/1461725216470.pdf; Supplier: LCSC; Connector Type: Battery button; Battery Type: CR2032
C231 C234 C236 = CL10A106MA8NRNC: Capacitance: Tolerance:±20% Tolerance:±20% Voltage Rated: Temperature Coefficient:; LCSC Part Name: 10uF ±20% 25V; Supplier Part: C96446; Manufacturer: SAMSUNG(三星); Supplier Footprint: 0603; JLCPCB Part Class: Basic Part; Datasheet: https://atta.szlcsc.com/upload/public/pdf/source/20160218/1457707763339.pdf; Supplier: LCSC; Tolerance: ±20%
D1 = SS34_C8678: Diode Configuration:Independent Type Forward Voltage (Vf@If):550mV@3A Reverse Voltage (Vr):40V Rectified Current:3A Reverse Leakage Current (Ir):500uA@40V; LCSC Part Name: 电压:40V 电流:3A; Supplier Part: C8678; Manufacturer: MDD(辰达半导体); Supplier Footprint: SMA(DO-214AC); JLCPCB Part Class: Basic Part; Datasheet: https://atta.szlcsc.com/upload/public/pdf/source/20240710/2118BB86FDDB2E0B294389AC1F3F65C8.pdf; Supplier: LCSC; Diode Configuration: Independent Type; Forward Voltage (Vf@If): 550mV@3A; Reverse Voltage (Vr): 40V; Rectified Current: 3A; Reverse Leakage Current (Ir): 500uA@40V
L2 = FXL0530-100-M: Inductance: Tolerance:±20% Tolerance:±20% Rated Current: Saturation Current (Isat):3.5A DC Resistance (DCR): Type:Integrated molded inductor; LCSC Part Name: 10uH ±20% 3.5A; Supplier Part: C177248; Manufacturer: cjiang(长江微电); Supplier Footprint: SMD,5.2x5.4mm; JLCPCB Part Class: Extended Part; Datasheet: https://atta.szlcsc.com/upload/public/pdf/source/20240426/3189EA8206330E2108542F9E34E540E7.pdf; Supplier: LCSC; Tolerance: ±20%; Saturation Current (Isat): 3.5A; Type: Integrated molded inductor
LED1 = KT-0805G: Lamp Holder Type:- Emitted Color:Emerald Forward Voltage (VF):- Forward Voltage (VF):- Power Dissipation:- Forward Current:- Dominant Wavelength:- Dominant Wavelength:- Peak Wavelength:- Diode Configuration:- Lens Color:- Color Temperature:- Color Tempera; LCSC Part Name: 0805 翠绿 高亮; Supplier Part: C2297; Manufacturer: KENTO; Supplier Footprint: 0805; JLCPCB Part Class: Basic Part; Datasheet: https://atta.szlcsc.com/upload/public/pdf/source/20170209/1486607340485.pdf; Supplier: LCSC; Emitted Color: Emerald
P3 = WJ500V-5.08-3P: Structure:1x3P Pitch:5.08mm Color:Green Mounting Style:Straight Current Rating (Max):18A Voltage Rating (Max):250V Number of Pins:3P Number of Rows:1 Wire Gauge - AWG:14~30 Wire Gauge - AWG:14~30 Wire Gauge - mm2:2.5 Wire Gauge - mm2:2.5 Number of PINs Pe; LCSC Part Name: 5.08mm 1x3P 排数:1 每排P数:3 直插; Supplier Part: C72334; Manufacturer: KANGNEX(康奈克斯电气); Supplier Footprint: 插件,P=5.08mm; JLCPCB Part Class: Extended Part; Datasheet: https://atta.szlcsc.com/upload/public/pdf/source/20191225/C72334_8A5EF831D67650233B6B1E3F2BC06274.pdf; Supplier: LCSC; Structure: 1x3P; Pitch: 5.08mm; Color: Green; Mounting Style: Straight; Current Rating (Max): 18A; Voltage Rating (Max): 250V; Number of Pins: 3P; Number of Rows: 1; Wire Gauge - AWG: 14~30; Wire Gauge - mm2: 2.5; Number of PINs Per Row: 3; Operating Temperature Range: -40℃~+105℃
R225 = RLP25FEGR020: Type:- Resistance: Tolerance:±1% Tolerance:±1% Rated Output Voltage:- Power(Watts): Rated Current:- Temperature Coefficient:±50ppm/℃ Temperature Coefficient:±50ppm/℃ Mounting Sytle:; LCSC Part Name: 20mΩ ±1% 3W; Supplier Part: C393069; Manufacturer: 大毅科技; Supplier Footprint: 2512; JLCPCB Part Class: Extended Part; Datasheet: https://atta.szlcsc.com/upload/public/pdf/source/20191209/C467441_D59F70B0A5C6980F35DB1CB3CCA97CC4.pdf; Supplier: LCSC; Tolerance: ±1%; Temperature Coefficient: ±50ppm/℃
R229 R230 = RTT06R40JTP: Type:Thick Film Resistors Resistance: Tolerance:±5% Tolerance:±5% Power(Watts): Overload Voltage (Max): Temperature Coefficient:±200ppm/℃ Temperature Coefficient:±200ppm/℃ Operating Temperature Range:-55℃~+155℃ Operating Temperature Range:-55℃~+155℃; LCSC Part Name: 厚膜电阻 400mΩ ±5% 333.333mW; Supplier Part: C159399; Manufacturer: RALEC(旺诠); Supplier Footprint: 1206; JLCPCB Part Class: Extended Part; Datasheet: https://atta.szlcsc.com/upload/public/pdf/source/20191219/C158410_884373A5B7E1BC76BF57BC45A946C093.pdf; Supplier: LCSC; Type: Thick Film Resistors; Tolerance: ±5%; Temperature Coefficient: ±200ppm/℃; Operating Temperature Range: -55℃~+155℃
R232 = 1206W4F100LT5E: Type:Thick Film Resistors Resistance:100mΩ Tolerance:±1% Tolerance:±1% Power(Watts): Overload Voltage (Max): Temperature Coefficient:±800ppm/℃ Temperature Coefficient:±800ppm/℃ Operating Temperature Range:-55℃~+155℃ Operating Temperature Range:-55℃~+155℃; LCSC Part Name: 100mΩ ±1% 250mW 厚膜电阻; Supplier Part: C25334; Manufacturer: UNI-ROYAL(厚声); Supplier Footprint: 1206; JLCPCB Part Class: Basic Part; Datasheet: https://atta.szlcsc.com/upload/public/pdf/source/20200306/C422600_1E6D84923E4A46A82E41ADD87F860B5C.pdf; Supplier: LCSC; Type: Thick Film Resistors; Tolerance: ±1%; Temperature Coefficient: ±800ppm/℃; Operating Temperature Range: -55℃~+155℃
R233 = 0402WGJ030JTCE: Type:Thick Film Resistors Resistance:3Ω Tolerance:±5% Tolerance:±5% Power(Watts): Overload Voltage (Max): Temperature Coefficient:±200ppm/℃ Temperature Coefficient:±200ppm/℃ Operating Temperature Range:-55℃~+155℃ Operating Temperature Range:-55℃~+155℃; LCSC Part Name: 3Ω ±5% 62.5mW 厚膜电阻; Supplier Part: C270411; Manufacturer: UNI-ROYAL(厚声); Supplier Footprint: 0402; JLCPCB Part Class: Extended Part; Datasheet: https://atta.szlcsc.com/upload/public/pdf/source/20200306/C422600_1E6D84923E4A46A82E41ADD87F860B5C.pdf; Supplier: LCSC; Type: Thick Film Resistors; Tolerance: ±5%; Temperature Coefficient: ±200ppm/℃; Operating Temperature Range: -55℃~+155℃
SW3 = SS12D07VG4 087: Circuit:SPDT Actuator Style:- Pin Style:PCPin Switch Length:8.7mm Switch Width:4.4mm Switch Height:4.7mm Mounting Style:Straight Actuator Color:- Current Rating (DC):500mA Voltage Rating (DC):50V Current Rating (AC):- Voltage Rating (AC):- Mechanical Life; Supplier Part: C2939726; Manufacturer: SHOU HAN(首韩); Supplier Footprint: 插件; JLCPCB Part Class: Extended Part; Datasheet: https://atta.szlcsc.com/upload/public/pdf/source/20220106/E715996F66241B9FD900079FF66489BE.pdf; Supplier: LCSC; Circuit: SPDT; Pin Style: PCPin; Switch Length: 8.7mm; Switch Width: 4.4mm; Switch Height: 4.7mm; Mounting Style: Straight; Current Rating (DC): 500mA; Voltage Rating (DC): 50V; Mechanical Life: 5千次; Operating Temperature: -10℃~+50℃
SW4 SW8 = K3-1391B-51: Circuit:Single Pole Double Throw (SPDT) Actuator Style:Rectangular column Pin Style:PCPin Switch Length:13.3mm Switch Width:6mm Switch Height:6.6mm Mounting Style:- Actuator Color:Black Current Rating (AC):5A Voltage Rating (AC):120V Mechanical Life:30,00; LCSC Part Name: 卧插双档 滑动开关; Supplier Part: C92656; Manufacturer: 韩国韩荣; Supplier Footprint: 插件; JLCPCB Part Class: Extended Part; Datasheet: https://atta.szlcsc.com/upload/public/pdf/source/20200417/C92656_C9D6734602329AAA248C31EF7FB16FDE.pdf; Supplier: LCSC; Circuit: Single Pole Double Throw (SPDT); Actuator Style: Rectangular column; Pin Style: PCPin; Switch Length: 13.3mm; Switch Width: 6mm; Switch Height: 6.6mm; Actuator Color: Black; Current Rating (AC): 5A; Voltage Rating (AC): 120V; Mechanical Life: 30,000 Times; Operating Temperature: -25℃~+80℃
U10 = INA226AIDGSR: Number of Channels:- Vcm - Common Mode Voltage:300mV~40V Vcm - Common Mode Voltage:300mV~40V Gain:- Bandwidth:- Ib - Input Bias Current:- Vos - Input Offset Voltage:- Voltage - Supply:2.7V~5.5V Voltage - Supply:2.7V~5.5V Current - Supply:- Operating Tempe; Supplier Part: C49851; Manufacturer: TI(德州仪器); Supplier Footprint: MSOP-10; JLCPCB Part Class: Extended Part; Datasheet: https://atta.szlcsc.com/upload/public/pdf/source/20231204/F50A9EB86BE78FEA83E070C913617774.pdf; Supplier: LCSC; Vcm - Common Mode Voltage: 300mV~40V; Voltage - Supply: 2.7V~5.5V; Operating Temperature: -40℃~+125℃
U21 = TP5100_C379389: Supplier Part: C379389; Manufacturer: TOPPOWER(南京拓微); Supplier Footprint: TQFN-16-EP(4x4); JLCPCB Part Class: Extended Part; Datasheet: https://atta.szlcsc.com/upload/public/pdf/source/20230625/310531CA6E48A76C009AF7A61C581768.pdf; Supplier: LCSC

## Nets
1.1V: C7.1 C8.1 C10.1 C11.1 L1.2 U1.10(DVDD) U1.32(DVDD) U1.51(DVDD) U1.65(VREG_FB)
3.3V: C2.2 C5.1 C6.1 C12.1 C13.1 C14.1 C15.1 C16.1 C17.1 C18.1 C20.1 C21.1 C201.2 C219.1 J3.18 J3.20 J3.22 J3.24 J3.26 J3.28 J3.30 J3.32 J3.34 J3.36 R1.2 R3.1 R217.2 R218.2 R234.1 U1.5(IOVDD) U1.15(IOVDD) U1.24(IOVDD) U1.29(IOVDD) U1.41(IOVDD) U1.50(IOVDD) U1.59(ADC_AVDD) U1.60(IOVDD) U1.64(VREG_VIN) U1.68(USB_OTP_VDD) U1.69(QSPI_IOVDD) U1.76(IOVDD) U3.8(VCC) U5.2(OUTPUT) U10.6(VS+) ; also on sheet 4 5 6 7
3.7V: BT1.2 BT2.1 P3.2
7.4V: SW3.1 SW4.2 ; also on sheet 6
12V: SW8.3 ; also on sheet 6
+5V: C1.1 U5.3(INPUT) USB1.2(VBUS) USB1.11(VBUS)
GND: BT1.1 BT4.2 C1.2 C2.1 C3.2 C4.1 C5.2 C6.2 C7.2 C8.2 C9.2 C10.2 C11.2 C12.2 C13.2 C14.2 C15.2 C16.2 C17.2 C18.2 C20.2 C21.2 C101.2 C102.1 C123.2 C124.2 C201.1 C212.2 C213.2 C214.2 C215.2 C216.2 C217.2 C218.1 C219.2 C230.2 C231.1 C232.2 C233.2 C234.1 C235.2 C236.1 C237.2 D1.2(A) D2.1(A) D3.1(A) D4.1(A) D5.1(A) J2.2 J2.4 J2.6 J2.8 J2.10 J2.12 J2.14 J2.16 J2.18 J2.20 J2.22 J2.24 J2.26 J2.28 J2.30 J2.32 J2.34 J2.36 J2.38 J2.40 J4.1 J4.3 J4.5 J4.7 J4.9 J4.11 J4.13 J4.15 J4.17 J4.19 J4.21 J4.23 J4.25 J4.27 J4.29 J4.31 J4.33 J4.35 J4.37 J4.39 LED3.1(K) LED4.1(K) P3.1 R4.2 R6.2 R206.2 R207.2 R210.2 R211.2 R215.1 R216.1 R220.2 SW3.4 SW3.5 SW4.3 SW6.1 SW7.1 U1.62(VREG_PGND) U1.81(GND) U2.1(GND) U2.15(GND) U2.38(GND) U2.39(GND) U3.4(GND) U5.1(ADJ/GND) U6.2(GND) U6.4(GND) U7.1(ADJ/GND) U10.7(GND) U15.3(GND) U15.29(EP) U21.7(GND) U21.11(TS) U21.17(EP) USB1.1(GND) USB1.12(GND) USB1.13(SHELL) USB1.14(SHELL) USB2.1(GND) USB2.12(GND) USB2.13(SHELL) USB2.14(SHELL) ; also on sheet 4 5 6 7
VBUS: R225.2 SW3.2 U10.8(VBUS) U10.9(VIN-)
VBUS-OUT: J3.40 SW3.3
VIN+: J3.38 R225.1 U10.10(VIN+)
A0: R215.2 U10.2(A0)
A1: R216.2 U10.1(A1)
ALE: U10.3(Alert)
BAT: BT2.2 C235.1 C236.2 P3.3 R232.2 SW4.1 U21.9(BAT)
BLA: J4.30 U1.43(GPIO34) ; also on sheet 4
CHRG: LED2.1(K) U21.15(CHRG#)
COM_RXD: U1.6(GPIO8) U2.27(IO16)
COM_TXD: U1.7(GPIO9) U2.28(IO17)
CR_3V: BT4.1 ; also on sheet 5 7
CS: J3.35 U1.22(GPIO22) ; also on sheet 4
CS2: J4.32 U1.44(GPIO35) ; also on sheet 4
CTS: U15.23(CTS)
DC: J4.38 U1.47(GPIO38) ; also on sheet 4
DCD: U15.1(DCD)
DI: J3.39 U1.20(GPIO20) ; also on sheet 4
DO: J4.2 U1.19(GPIO19) ; also on sheet 4
DSR: U15.27(DSR)
DTR: Q3.2(E) R121.1 U15.28(DTR)
EN: Q4.3(C) R223.2
ESP_3.3V: C101.1 C102.2 C124.1 C212.1 C213.1 R212.1 R221.1 R235.1 U2.2(VDD33) U7.2(OUTPUT) ; also on sheet 6
ESP_5V: C123.1 C217.1 C218.2 U7.3(INPUT) U15.8(VBUS) USB2.2(VBUS) USB2.11(VBUS)
ESP_D+: D5.2(K) U15.4(D+) USB2.6(DP1) USB2.8(DP2)
ESP_D-: D4.2(K) U15.5(D-) USB2.5(DN2) USB2.7(DN1)
ESP_EN: C214.1 R212.2 U2.3(EN)
GPIO0: J3.1 U1.77(GPIO0)
GPIO1: J3.3 U1.78(GPIO1)
GPIO2: J3.5 U1.79(GPIO2)
GPIO3: J3.7 U1.80(GPIO3)
GPIO4: J3.9 U1.1(GPIO4)
GPIO5: J3.11 U1.2(GPIO5)
GPIO6: J3.13 U1.3(GPIO6)
GPIO7: J3.15 U1.4(GPIO7)
GPIO8: J3.17
GPIO9: J3.19
GPIO10: J3.21 U1.8(GPIO10)
GPIO11: J3.23 U1.9(GPIO11)
GPIO12: J3.25 U1.11(GPIO12) ; also on sheet 5
GPIO13: J3.27 U1.12(GPIO13) ; also on sheet 5
GPIO14: J3.29 U1.13(GPIO14) ; also on sheet 7
GPIO15: J3.31 U1.14(GPIO15) ; also on sheet 7
GPIO16: J3.33 U1.23(GPIO23) ; also on sheet 7
GPIO18: J3.37 U1.21(GPIO21) ; also on sheet 4
GPIO21: J4.4 U1.18(GPIO18)
GPIO22: J4.6 U1.17(GPIO17)
GPIO23: J4.8 U1.16(GPIO16)
GPIO24: J4.10 U1.25(GPIO24)
GPIO25: J4.12 U1.26(GPIO25)
GPIO26: J4.14 U1.27(GPIO26)
GPIO27: J4.16 U1.28(GPIO27)
GPIO28: J4.18 U1.36(GPIO28)
GPIO29: J4.20 U1.37(GPIO29)
GPIO30: J4.22 U1.38(GPIO30)
GPIO31: J4.24 U1.39(GPIO31)
GPIO32: J4.26 U1.40(GPIO32)
GPIO33: J4.28 U1.42(GPIO33)
GPIO36: J4.34 R217.1 U1.45(GPIO36) U10.4(SDA) ; also on sheet 4 5 7
GPIO37: J4.36 R218.1 U1.46(GPIO37) U10.5(SCL) ; also on sheet 4 5 7
GPIO39: J4.40 U1.48(GPIO39) ; also on sheet 4
GPIO40_ADC0: J3.2 U1.49(GPIO40_ADC0)
GPIO41_ADC1: J3.4 U1.52(GPIO41_ADC1)
GPIO42_ADC2: J3.6 U1.53(GPIO42_ADC2)
GPIO43_ADC3: J3.8 U1.54(GPIO43_ADC3)
GPIO44_ADC4: J3.10 U1.55(GPIO44_ADC4)
GPIO45_ADC5: J3.12 U1.56(GPIO45_ADC5)
GPIO46_ADC6: J3.14 U1.57(GPIO46_ADC6)
GPIO47_ADC7: J3.16 U1.58(GPIO47_ADC7)
IO0: J2.1 Q3.3(C) R221.2 R222.2 U2.25(IO0)
IO2: J2.3 R220.1 U2.24(IO2)
IO4: J2.5 U2.26(IO4)
IO5: J2.7 U2.29(IO5)
IO12: J2.9 U2.14(IO12)
IO13: J2.11 U2.16(IO13)
IO14: J2.13 U2.13(IO14)
IO15: J2.15 U2.23(IO15)
IO18: J2.17 U2.30(IO18)
IO19: J2.19 U2.31(IO19)
IO21: J2.21 U2.33(IO21)
IO22: J2.23 U2.36(IO22)
IO23: J2.25 U2.37(IO23)
IO25: J2.27 U2.10(IO25)
IO26: J2.29 U2.11(IO26)
IO27: J2.31 U2.12(IO27)
IO32: J2.33 U2.8(IO32)
IO33: J2.35 U2.9(IO33)
IO34: J2.37 U2.6(IO34)
IO35: J2.39 U2.7(IO35)
LX: D1.1(K) L2.1 R233.1 U21.2(LX) U21.3(LX)
QSPI_SCLK: U1.71(QSPI_SCLK) U3.6(CLK)
QSPI_SD0: U1.72(QSPI_SD0) U3.5(DI)
QSPI_SD1: U1.74(QSPI_SD1) U3.2(DO)
QSPI_SD2: U1.73(QSPI_SD2) U3.3(IO2)
QSPI_SD3: U1.70(QSPI_SD3) U3.7(IO3)
QSPI_SS: R1.1 SW2.1 U1.75(QSPI_SS) U3.1(CS#)
RI: U15.2(RI)
RTS: Q4.2(E) R122.1 U15.24(RTS)
RUN: SW1.1 U1.35(RUN)
RXD0: R224.2 U2.34(RXD0)
STDBY: LED1.2(K) U21.14(STDBY#)
SWCLK: U1.33(SWCLK)
SWDIO: U1.34(SWDIO)
TP-RES: R229.1 R230.1 SW8.2
TP_VIN: C230.1 C231.2 R229.2 R230.2 R231.1 U21.1(VIN) U21.4(VIN) U21.5(VIN) U21.16(VIN)
TXD0: U2.35(TXD0) U15.25(RXD)
USB_D+R: R7.2 U1.67(USB_DP)
USB_D-R: R8.2 U1.66(USB_DM)
VREG: C232.1 U21.10(VREG) U21.13(CS)
VREG_AVDD: C9.1 R3.2 U1.61(VREG_AVDD)
VREG_LX: L1.1 U1.63(VREG_LX)
VS: C233.1 C234.2 L2.2 R232.1 U21.8(VS)
XIN: C3.1 U1.30(XIN) U6.1
XOUT: R2.2 U1.31(XOUT)
$1N4939: R4.1 SW1.2
$1N5102: R6.1 SW2.2
$1N7824: R206.1 USB1.4(CC1)
$1N7904: R207.1 USB1.10(CC2)
$1N7947: D2.2(K) R8.1 USB1.5(DN2) USB1.7(DN1)
$1N7996: D3.2(K) R7.1 USB1.6(DP1) USB1.8(DP2)
$1N14410: C4.2 R2.1 U6.3
$1N30645: LED3.2(A) R234.2
$2N2617: R210.1 USB2.4(CC1)
$2N2621: R211.1 USB2.10(CC2)
$2N9694: C215.1 R222.1 SW6.2
$2N9917: C216.1 R223.1 SW7.2
$2N10475: R224.1 U15.26(TXD)
$2N10716: Q4.1(B) R121.2
$2N10759: Q3.1(B) R122.2
$2N12969: LED4.2(A) R235.2
$3N7092: LED1.1(A) LED2.2(A) R231.2
$3N9017: C237.1 R233.2

Not connected (* = marked no-connect by the designer): SW4 4(EH); SW8 1 4(EH); U2 4(SENSOR_VP)* 5(SENSOR_VN)* 17(SD2)* 18(SD3)* 19(CMD)* 20(CLK)* 21(SD0)* 22(SD1)* 32(NC)*; U15 6(VDD) 7(REGIN) 9(RST#)* 10(NC)* 11(SUSPEND#) 12(SUSPEND)* 13(NC)* 14(NC)* 15(NC)* 16(NC)* 17(NC)* 18(NC)* 19(NC)* 20(NC)* 21(NC)* 22(NC)*; U21 6(PWR_ON-)* 12(RTRICK)*; USB1 3(SBU2)* 9(SBU1)*; USB2 3(SBU2)* 9(SBU1)*

## Notes on the sheets
sheet 1
- POWER (USB)
- POWER (Inductor)
- RP2350B
sheet 2
- POWER (USB)
- POWER (LDO)
- BUTTONS
- ESP32
sheet 3
- BATTERY & INA
- BATTERIES &
  Switch
- INA226
